# Altium schematic sheet Top.SchDoc: Top: fuente + 2 canales de entrada (ejemplo 06)
size A4; Author: Efrain Alvarado; CompanyName: Universidad de Cuenca - MCIE; DrawnBy: Efrain Alvarado; DocumentNumber: E06-T; Revision: 1.0; SheetNumber: 1; SheetTotal: 3
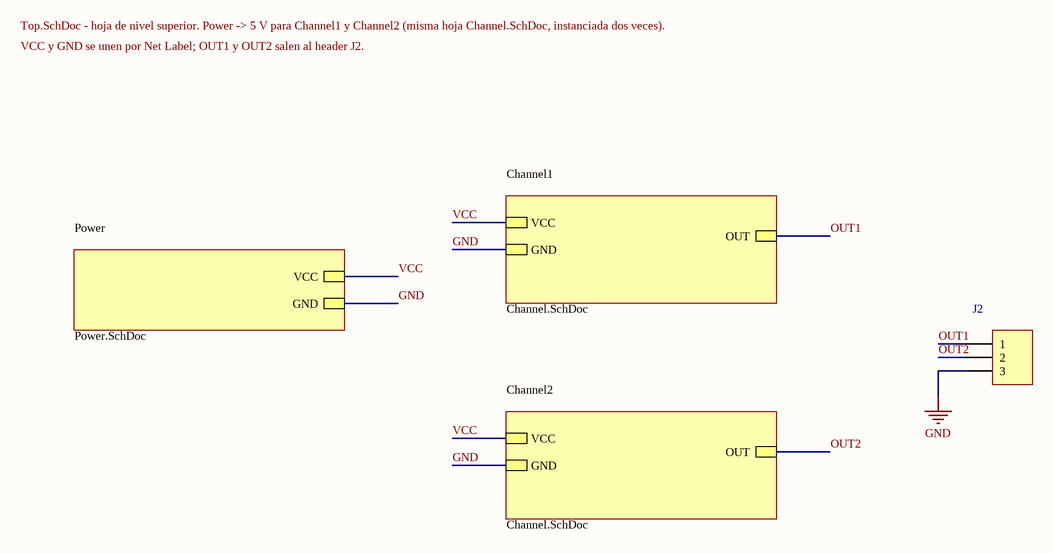
[diagram p0: Top.SchDoc]

## Parts
J2  Header 3  [HDR1X3]  (value not drawn)

## Sub-sheets
Channel1 = Channel.SchDoc: VCC, GND, OUT
Channel2 = Channel.SchDoc: VCC, GND, OUT
Power = Power.SchDoc: VCC, GND

## Nets
GND: J2.3 ; sheet Power/GND, sheet Channel1/GND, sheet Channel2/GND
OUT1: J2.1 ; sheet Channel1/OUT
OUT2: J2.2 ; sheet Channel2/OUT
VCC: sheet Power/VCC, sheet Channel1/VCC, sheet Channel2/VCC

## Notes on the sheet
- Top.SchDoc - hoja de nivel superior. Power -> 5 V para Channel1 y Channel2 (misma hoja Channel.SchDoc, instanciada dos veces).
- VCC y GND se unen por Net Label; OUT1 y OUT2 salen al header J2.

## Library data of the parts
J2 = Header 3: Header 3 pin: OUT1, OUT2, GND; Manufacturer: Generic; Manufacturer Part Number: Pin header 1x3; LatestRevisionDate: 17-Jul-2002; LatestRevisionNote: Re-released for DXP Platform.; Publisher: Altium Limited